# Altium project Gateway_WSN_2023_1.PrjPcb
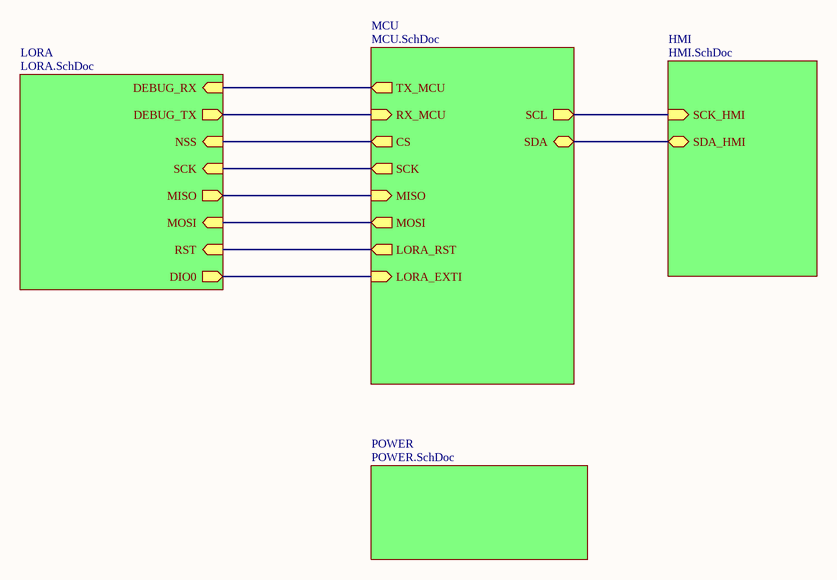
[diagram p0: MAIN.SchDoc]
5 sheets, 50 parts. Net scope: hierarchical (ports join the sheet entries above them; power ports are global).
Board file: PCB2.PcbDoc
Sheets:
  MAIN.SchDoc
    MCU = MCU.SchDoc
    LORA = LORA.SchDoc
    POWER = POWER.SchDoc
    HMI = HMI.SchDoc

## Sheet MAIN.SchDoc
size A4

### Sub-sheets
HMI = HMI.SchDoc: SCK_HMI (in), SDA_HMI (bidir)
LORA = LORA.SchDoc: DIO0 (out), DEBUG_RX (in), DEBUG_TX (out), SCK (in), NSS (in), RST (in), MISO (out), MOSI (in)
MCU = MCU.SchDoc: TX_MCU (out), RX_MCU (in), CS (out), SCK (out), MISO (in), MOSI (out), LORA_RST (out), LORA_EXTI (in), SCL (out), SDA (bidir)
POWER = POWER.SchDoc: no entries

### Nets
GPIO21: sheet MCU/SDA, sheet HMI/SDA_HMI
GPIO22: sheet MCU/SCL, sheet HMI/SCK_HMI
NetIC1_8: sheet MCU/LORA_EXTI, sheet LORA/DIO0
NetIC1_9: sheet MCU/LORA_RST, sheet LORA/RST
NetIC1_13: sheet MCU/CS, sheet LORA/NSS
NetIC1_27: sheet MCU/RX_MCU, sheet LORA/DEBUG_TX
NetIC1_28: sheet MCU/TX_MCU, sheet LORA/DEBUG_RX
NetIC1_30: sheet MCU/SCK, sheet LORA/SCK
NetIC1_31: sheet MCU/MISO, sheet LORA/MISO
NetIC1_37: sheet MCU/MOSI, sheet LORA/MOSI

## Sheet MCU.SchDoc
size A4
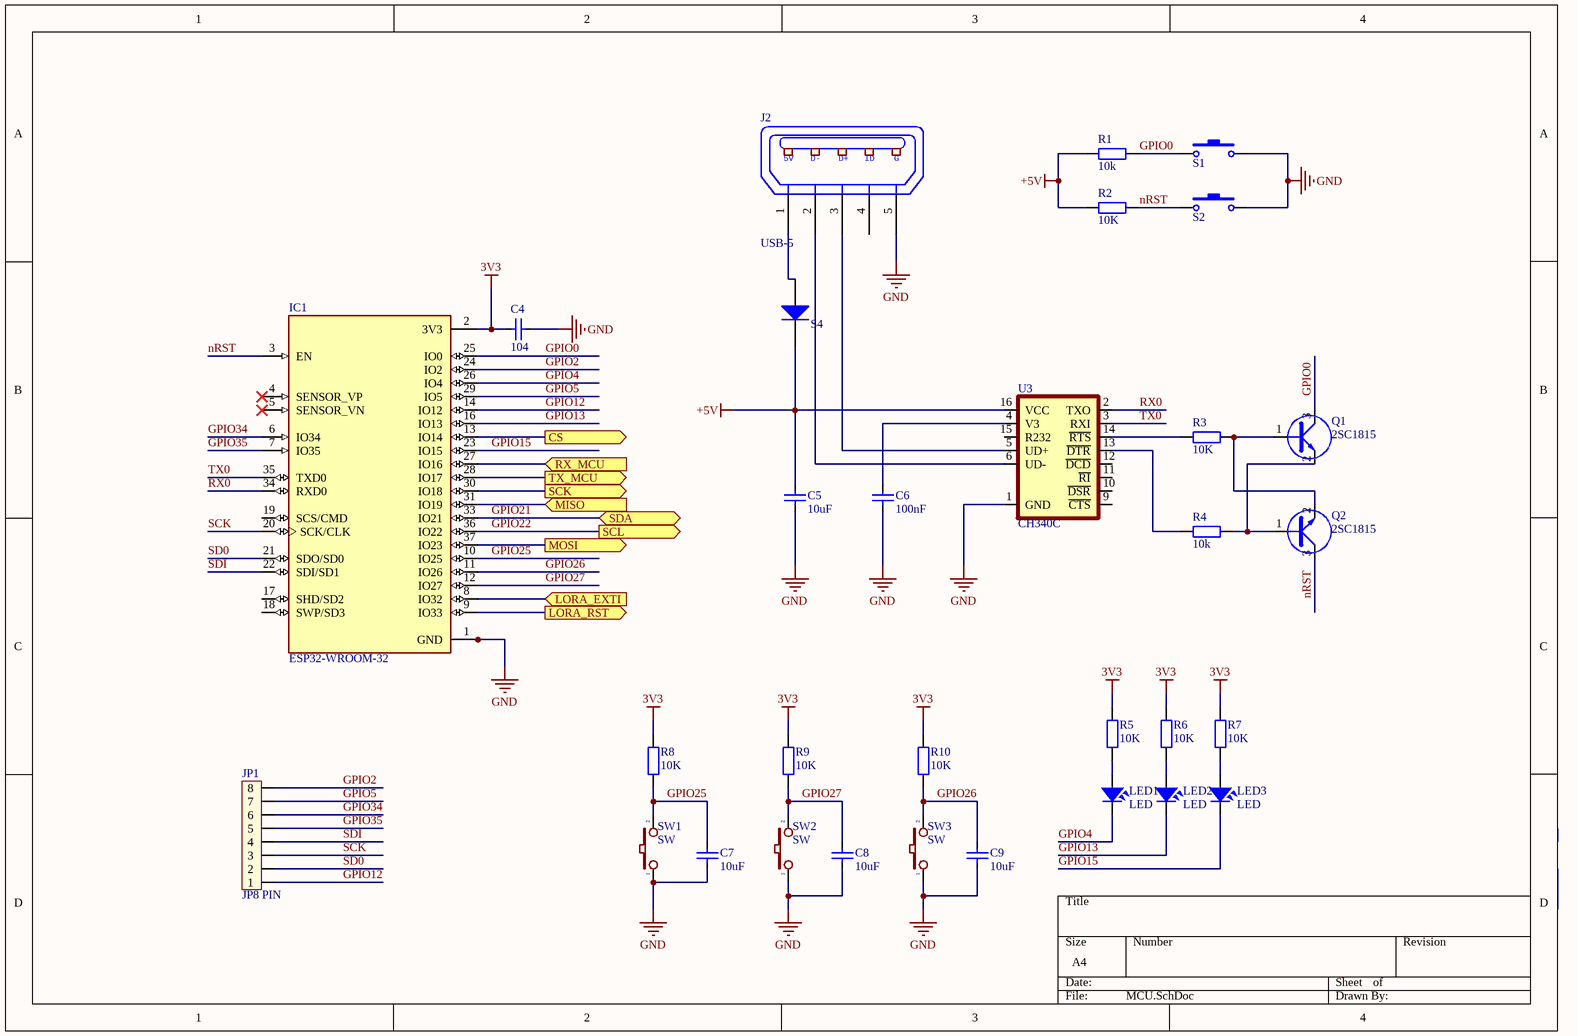
[diagram p1: MCU.SchDoc]

### Parts
C4  104  [CAP_0805]
C5  10uF  [CAP_0805]
C6  100nF  [CAP_0805]
C7  10uF  [CAP_0805]
C8  10uF  [CAP_0805]
C9  10uF  [CAP_0805]
IC1  ESP32-WROOM-32  [MODULE_ESP32-WROOM-32]
J2  USB-5  [USB-M1]
JP1  JP8 PIN  [JP8]
LED1  LED  [LED-0805-Blue]
LED2  LED  [LED-0805-Blue]
LED3  LED  [LED-0805-Blue]
Q1  2SC1815  [SOT23D]
Q2  2SC1815  [SOT23D]
R1  10k  [SM-0805]
R2  10K  [SM-0805]
R3  10K  [SM-0805]
R4  10k  [SM-0805]
R5  10K  [RES-SMD-0805]
R6  10K  [RES-SMD-0805]
R7  10K  [RES-SMD-0805]
R8  10K  [RES-SMD-0805]
R9  10K  [RES-SMD-0805]
R10  10K  [RES-SMD-0805]
S1  SW-SMD  [SW-SMD]  (value not drawn)
S2  SW-SMD  [SW-SMD]  (value not drawn)
SW1  SW  [SW2]
SW2  SW  [SW2]
SW3  SW  [SW2]
U3  CH340C  [SOP-16]
  S4  [DIO-214AC(SMA)]

### Ports
CS (out), LORA_EXTI (in), LORA_RST (out), MISO (in), MOSI (out), RX_MCU (in), SCK (out), SCL (out), SDA (bidir), TX_MCU (out)

### Nets
3V3: C4.1 IC1.2(3V3) R5.1 R6.1 R7.1 R8.1 R9.1 R10.1
+5V: C5.1 R1.1 R2.1 U3.16(VCC) .2(K)
GND: C4.2 C5.2 C6.2 C7.1 C8.1 C9.1 IC1.1(GND) IC1.15(GND) IC1.38(GND) IC1.39_1(GND) IC1.39_2(GND) IC1.39_3(GND) IC1.39_4(GND) IC1.39_5(GND) IC1.39_6(GND) IC1.39_7(GND) IC1.39_8(GND) IC1.39_9(GND) IC1.39_10(GND) IC1.39_11(GND) IC1.39_12(GND) IC1.39_13(GND) IC1.39_14(GND) IC1.39_15(GND) IC1.39_16(GND) IC1.39_17(GND) IC1.39_18(GND) IC1.39_19(GND) IC1.39_20(GND) IC1.39_21(GND) J2.5(P5) S1.2 S2.2 SW1.1 SW2.1 SW3.1 U3.1(GND)
GPIO0: IC1.25(IO0) Q1.3(C) R1.2 S1.1
GPIO2: IC1.24(IO2) JP1.8
GPIO4: IC1.26(IO4) LED1.2
GPIO5: IC1.29(IO5) JP1.7
GPIO12: IC1.14(IO12) JP1.1
GPIO13: IC1.16(IO13) LED2.2
GPIO15: IC1.23(IO15) LED3.2
GPIO21: IC1.33(IO21) ; port SDA
GPIO22: IC1.36(IO22) ; port SCL
GPIO25: C7.2 IC1.10(IO25) R8.2 SW1.2
GPIO26: C9.2 IC1.11(IO26) R10.2 SW3.2
GPIO27: C8.2 IC1.12(IO27) R9.2 SW2.2
GPIO34: IC1.6(IO34) JP1.6
GPIO35: IC1.7(IO35) JP1.5
nRST: IC1.3(EN) Q2.3(C) R2.2 S2.1
RX0: IC1.34(RXD0) U3.2(TXO)
SCK: IC1.20(SCK/CLK) JP1.3
SD0: IC1.21(SDO/SD0) JP1.2
SDI: IC1.22(SDI/SD1) JP1.4
TX0: IC1.35(TXD0) U3.3(RXI)
NetC6_1: C6.1 U3.4(V3)
NetIC1_8: IC1.8(IO32) ; port LORA_EXTI
NetIC1_9: IC1.9(IO33) ; port LORA_RST
NetIC1_13: IC1.13(IO14) ; port CS
NetIC1_27: IC1.27(IO16) ; port RX_MCU
NetIC1_28: IC1.28(IO17) ; port TX_MCU
NetIC1_30: IC1.30(IO18) ; port SCK
NetIC1_31: IC1.31(IO19) ; port MISO
NetIC1_37: IC1.37(IO23) ; port MOSI
NetJ2_1: J2.1(P1) .1(A)
NetJ2_2: J2.2(P2) U3.6(UD-)
NetJ2_3: J2.3(P3) U3.5(UD+)
NetLED1_1: LED1.1 R5.2
NetLED2_1: LED2.1 R6.2
NetLED3_1: LED3.1 R7.2
NetQ1_1: Q1.1(B) Q2.2(E) R3.2
NetQ1_2: Q1.2(E) Q2.1(B) R4.2
NetR3_1: R3.1 U3.14(~{RTS})
NetR4_1: R4.1 U3.13(~{DTR})

Not connected (* = marked no-connect by the designer): IC1 4(SENSOR_VP)* 5(SENSOR_VN)* 17(SHD/SD2) 18(SWP/SD3) 19(SCS/CMD); J2 4(P4); U3 9(~{CTS}) 10(~{DSR}) 11(~{RI}) 12(~{DCD}) 15(R232)

### Notes on the sheet
- (in symbol USB-5) 5V; D-; D+; ID; G

### Library data of the parts
C4-C9 = CapSMD: Capacitor; Value: 33p; Published: 8-Jun-2000; LatestRevisionDate: 17-Jul-2002; LatestRevisionNote: Re-released for DXP Platform.; PackageReference: RAD-0.3; Publisher: Altium Limited
IC1 = ESP32-WROOM-32: Bluetooth, WiFi Transceiver Module 2.4GHz ~ 2.5GHz Surface Mount; MF: Espressif Systems; Package: Module Espressif Systems; Digi-Key_Part_Number: 1904-1010-1-ND; Digi-Key_Purchase_URL: https://www.digikey.com/product-detail/en/espressif-systems/ESP32-WROOM-32/1904-1010-1-ND/8544305?utm_source=snapeda&utm_medium=aggregator&utm_campaign=symbol; Value: *; MP: ESP32-WROOM-32; SnapEDA_Link: https://www.snapeda.com/parts/ESP32-WROOM-32/Espressif%20Systems/view-part/2753322/?ref=snap
J2 = USB-5: Manufacturer: FCI; Manufacturer Part Number: 10118193-0001LF; Connector Type: USB - micro B; Number of Contacts: 5; Gender: Receptacle; Specifications: USB 2.0; .Creator: MM; .Checked PCB: RF; Supplier 1: Digi-Key; RoHS: RoHS Compliant; Category: Connectors, Interconnects; Stock 1: 28642; Pricing 1: 1=0.46, 10=0.433, 25=0.3712, 50=0.3156, 100=0.3032, 250=0.27224, 500=0.25988 (USD); Packaging: Cut Tape (CT); Mounting Type: Surface Mount, Right Angle, Horizontal; Features: Shielded, Solder Retention; Ingress Protection: -; ComponentLink1URL: http://portal.fciconnect.com/Comergent//fci/drawing/10118193.pdf; ComponentLink1Description: http://portal.fciconnect.com/Comergent//fci/drawing/10118193.pdf; Supplier Part Number 1: 609-4616-1-ND; .Checked SCH: MM
JP1 = JP8: Value: JP7
LED1-LED3 = LED: LED Single colour Green and Red; Value: LED 3 ly Single Colour
Q1 Q2 = C1815: NPN 600mW, ECB; Value: C1815
R1-R4 = RM: Resistor SMD; Value: 1K
R5-R10 = Resistor - SMD: Resistor SMD; Manufacturer: Generic Components; Class: Passive; Published: 08/06/2000; Publisher: Altium Hobart Technology Centre
S1 S2 = SW-SMD: Switch; Published: 24-Mar-1999; LatestRevisionDate: 17-Jul-2002; LatestRevisionNote: Re-released for DXP Platform.; PackageReference: SPST-2; Publisher: Altium Limited
SW1-SW3 = SW2: Switch button 2 pin; Value: SW chip 2 pin
U3 = CH340C: USB to serial chip CH340; MF: WCH; Package: Package; Check_prices: https://www.snapeda.com/parts/CH340C/WCH/view-part/5428851/?ref=eda; Value: *; Price: None; MP: CH340C; Availability: Unavailable; SnapEDA_Link: https://www.snapeda.com/parts/CH340C/WCH/view-part/5428851/?ref=snap
 = Diode S4: Dán; Ten_Linh_Kien: Diode S4 SOD123 ( 1N5819 SOD123); Ma_Hang: MH005519; Don_Vi: Con

## Sheet LORA.SchDoc
size A4
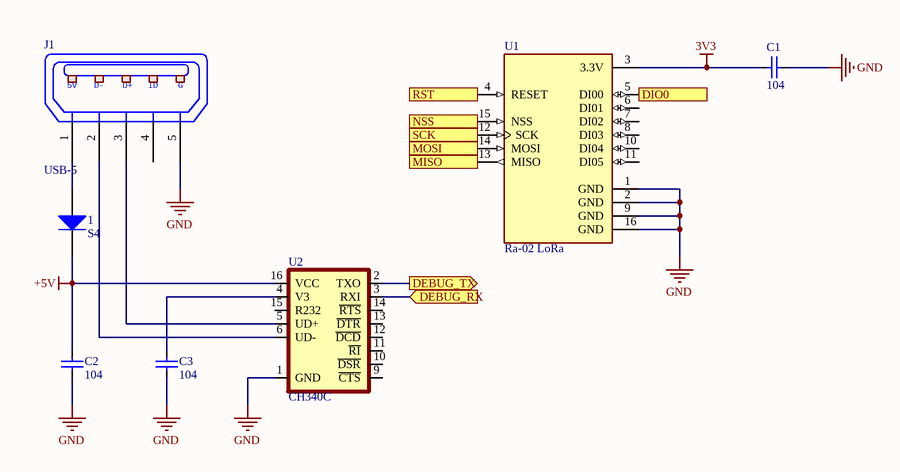
[diagram p2: LORA.SchDoc]

### Parts
1  S4  [DIO-214AC(SMA)]
C1  104  [CAP_0805]
C2  104  [CAP_0805]
C3  104  [CAP_0805]
J1  USB-5  [USB-M1]
U1  Ra-02 LoRa  [Ra-02]
U2  CH340C  [SOP-16]

### Ports
DEBUG_RX (in), DEBUG_TX (out), DIO0 (out), MISO (out), MOSI (in), NSS (in), RST (in), SCK (in)

### Nets
3V3: C1.2 U1.3(3.3V)
+5V: 1.2(K) C2.2 U2.16(VCC)
GND: C1.1 C2.1 C3.1 J1.5(P5) U1.1(GND) U1.2(GND) U1.9(GND) U1.16(GND) U2.1(GND)
Net1_1: 1.1(A) J1.1(P1)
NetC3_2: C3.2 U2.4(V3)
NetIC1_8: U1.5(DI00) ; port DIO0
NetIC1_9: U1.4(RESET) ; port RST
NetIC1_13: U1.15(NSS) ; port NSS
NetIC1_27: U2.2(TXO) ; port DEBUG_TX
NetIC1_28: U2.3(RXI) ; port DEBUG_RX
NetIC1_30: U1.12(SCK) ; port SCK
NetIC1_31: U1.13(MISO) ; port MISO
NetIC1_37: U1.14(MOSI) ; port MOSI
NetJ1_2: J1.2(P2) U2.6(UD-)
NetJ1_3: J1.3(P3) U2.5(UD+)

Not connected (* = marked no-connect by the designer): J1 4(P4); U1 6(DI01) 7(DI02) 8(DI03) 10(DI04) 11(DI05); U2 9(~{CTS}) 10(~{DSR}) 11(~{RI}) 12(~{DCD}) 13(~{DTR}) 14(~{RTS}) 15(R232)

### Notes on the sheet
- (in symbol USB-5) 5V; D-; D+; ID; G

### Library data of the parts
1 = Diode S4: as  on sheet MCU; Ghi_Chu: *; Chung_Loai: Dán; Kieu_Chan: *
C1-C3 = CapSMD: Capacitor; Value: 33p; Published: 8-Jun-2000; LatestRevisionDate: 17-Jul-2002; LatestRevisionNote: Re-released for DXP Platform.; PackageReference: RAD-0.3; Publisher: Altium Limited
J1 = USB-5: as J2 on sheet MCU; Supplier 1: Digi-Key; RoHS: RoHS Compliant; Category: Connectors, Interconnects; Stock 1: 28642; Pricing 1: 1=0.46, 10=0.433, 25=0.3712, 50=0.3156, 100=0.3032, 250=0.27224, 500=0.25988 (USD); Packaging: Cut Tape (CT); Mounting Type: Surface Mount, Right Angle, Horizontal; Features: Shielded, Solder Retention; Ingress Protection: -; ComponentLink1URL: http://portal.fciconnect.com/Comergent//fci/drawing/10118193.pdf; ComponentLink1Description: http://portal.fciconnect.com/Comergent//fci/drawing/10118193.pdf; Supplier Part Number 1: 609-4616-1-ND; .Checked SCH: MM
U1 = Ra-02 LoRa: LoRa Module Ra-02
U2 = CH340C: USB to serial chip CH340; MF: WCH; Package: Package; Check_prices: https://www.snapeda.com/parts/CH340C/WCH/view-part/5428851/?ref=eda; Value: *; Price: None; MP: CH340C; Availability: Unavailable; SnapEDA_Link: https://www.snapeda.com/parts/CH340C/WCH/view-part/5428851/?ref=snap

## Sheet POWER.SchDoc
size A4
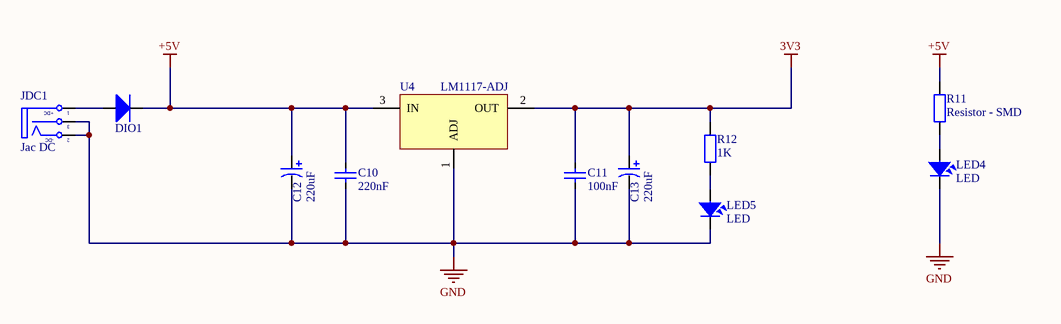
[diagram p3: POWER.SchDoc]

### Parts
C10  220nF  [CAP_0805]
C11  100nF  [CAP_0805]
C12  220uF  [CAP_7343]
C13  220uF  [CAP_7343]
DIO1  Diode SMD  [DIO-214AC(SMA)]  (value not drawn)
JDC1  Jac DC  [DC-IN]
LED4  LED  [LED-0805-Blue]
LED5  LED  [LED-0805-Red]
R11  Resistor - SMD  [RES-SMD-0805]
R12  1K  [RES-SMD-0805]
U4  LM1117-ADJ  [LM1117-SOP]

### Nets
3V3: C11.2 C13.1 R12.1 U4.2(OUT)
+5V: C10.2 C12.1 DIO1.2(K) R11.1 U4.3(IN)
GND: C10.1 C11.1 C12.2 C13.2 JDC1.2(TN) JDC1.3(S) LED4.2 LED5.2 U4.1(ADJ)
NetDIO1_1: DIO1.1(A) JDC1.1(T)
NetLED4_1: LED4.1 R11.2
NetLED5_1: LED5.1 R12.2

### Notes on the sheet
- (in symbol DCIN) +DC; -DC

### Library data of the parts
C10 C11 = CapSMD: Capacitor; Value: 33p; Published: 8-Jun-2000; LatestRevisionDate: 17-Jul-2002; LatestRevisionNote: Re-released for DXP Platform.; PackageReference: RAD-0.3; Publisher: Altium Limited
C12 C13 = CAP_TAN_SMD: Polazied Tantalum Capacitor
DIO1 = Diode SMD: Default Diode; Code - JEDEC: DO-214-AB; Value: 1N5007; Published: 8-Jun-2000; Revision: July-2002: Re-released for DXP Platform.; Publisher: Altium Limited
JDC1 = DCIN: Jac DC input; Value: Jac DC
LED4 LED5 = LED: as LED1 on sheet MCU
R11 R12 = Resistor - SMD: as R5 on sheet MCU; Published: 08/06/2000; Publisher: Altium Hobart Technology Centre
U4 = LM1117-ADJ: 800mA Low-Dropout Linear Regulator; Creator: Nguyen Ba Bien; Website: http://group3i.net

## Sheet HMI.SchDoc
size A4
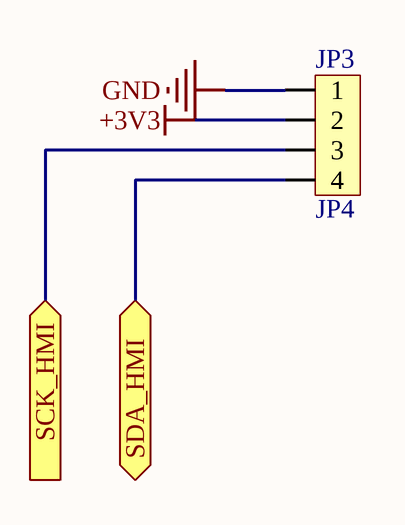
[diagram p4: HMI.SchDoc]

### Parts
JP3  JP4  [JP4-C1T]

### Ports
SCK_HMI (in), SDA_HMI (bidir)

### Nets
+3V3: JP3.2
GND: JP3.1
GPIO21: JP3.4 ; port SDA_HMI
GPIO22: JP3.3 ; port SCK_HMI

### Library data of the parts
JP3 = JP4: WR-PHD 2.54 mm Angled Socket Header; Manufacturer: W¨¹rth Elektronik eiSos GmbH; partNo: 613004143121; ComponentLink1 Description: Manufacturer; ComponentLink2 Description: Datasheet; NoPins: 04; Created Date: 29 March 2013; ComponentLink1URL: http://www.we-online.com; ComponentLink2URL: http://katalog.we-online.de/em/datasheet/6130xx143121.pdf; Created by: Karrer Zheng

## Nets that join several sheets
3V3: MCU (8 pins), LORA (C1.2 U1.3), POWER (C11.2 C13.1 R12.1 U4.2)
+5V: MCU (5 pins), LORA (1.2 C2.2 U2.16), POWER (5 pins)
GND: MCU (37 pins), LORA (9 pins), POWER (9 pins), HMI (JP3.1)
GPIO21: MCU (IC1.33), HMI (JP3.4)
GPIO22: MCU (IC1.36), HMI (JP3.3)
NetIC1_8: MCU (IC1.8), LORA (U1.5)
NetIC1_9: MCU (IC1.9), LORA (U1.4)
NetIC1_13: MCU (IC1.13), LORA (U1.15)
NetIC1_27: MCU (IC1.27), LORA (U2.2)
NetIC1_28: MCU (IC1.28), LORA (U2.3)
NetIC1_30: MCU (IC1.30), LORA (U1.12)
NetIC1_31: MCU (IC1.31), LORA (U1.13)
NetIC1_37: MCU (IC1.37), LORA (U1.14)